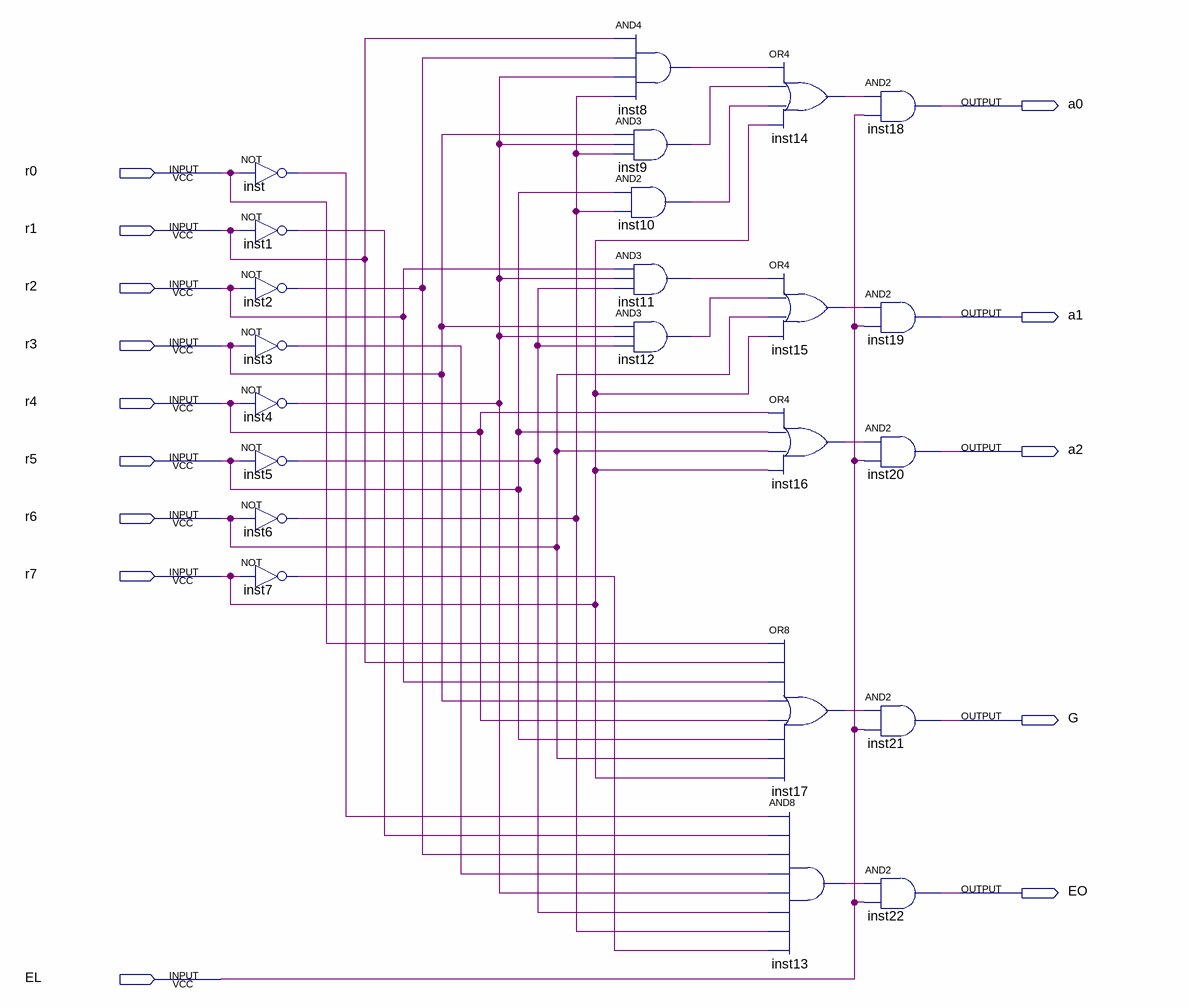
[diagram p0: schematic sheet]
// Quartus schematic point1.bdf as structural Verilog: 23 symbols, 14 pins
module point1 (
  input  r0,
  input  r1,
  input  r2,
  input  r3,
  input  r4,
  input  r5,
  input  r6,
  input  r7,
  input  EL,
  output a0,
  output a1,
  output a2,
  output G,
  output EO
);

  wire inst1_out, inst2_out, inst3_out, inst4_out, inst5_out, inst6_out, inst7_out, inst8_out, inst9_out,
       inst10_out, inst11_out, inst12_out, inst13_out, inst14_out, inst15_out, inst16_out, inst17_out,
       inst_out;

  not inst (inst_out, r0);
  not inst1 (inst1_out, r1);
  not inst2 (inst2_out, r2);
  not inst3 (inst3_out, r3);
  not inst4 (inst4_out, r4);
  not inst5 (inst5_out, r5);
  not inst6 (inst6_out, r6);
  not inst7 (inst7_out, r7);
  and inst8 (inst8_out, r1, inst2_out, inst4_out, inst6_out);
  and inst9 (inst9_out, r3, inst4_out, inst6_out);
  and inst10 (inst10_out, r5, inst6_out);
  and inst11 (inst11_out, r2, inst4_out, inst5_out);
  and inst12 (inst12_out, r3, inst4_out, inst5_out);
  or inst14 (inst14_out, inst8_out, inst9_out, inst10_out, r7);
  or inst15 (inst15_out, inst11_out, inst12_out, r6, r7);
  or inst16 (inst16_out, r4, r5, r6, r7);
  or inst17 (inst17_out, r0, r1, r2, r3, r4, r5, r6, r7);
  and inst13 (inst13_out, inst_out, inst1_out, inst2_out, inst3_out, inst4_out, inst5_out, inst6_out, inst7_out);
  and inst18 (a0, inst14_out, EL);
  and inst19 (a1, inst15_out, EL);
  and inst20 (a2, inst16_out, EL);
  and inst21 (G, inst17_out, EL);
  and inst22 (EO, inst13_out, EL);
endmodule
